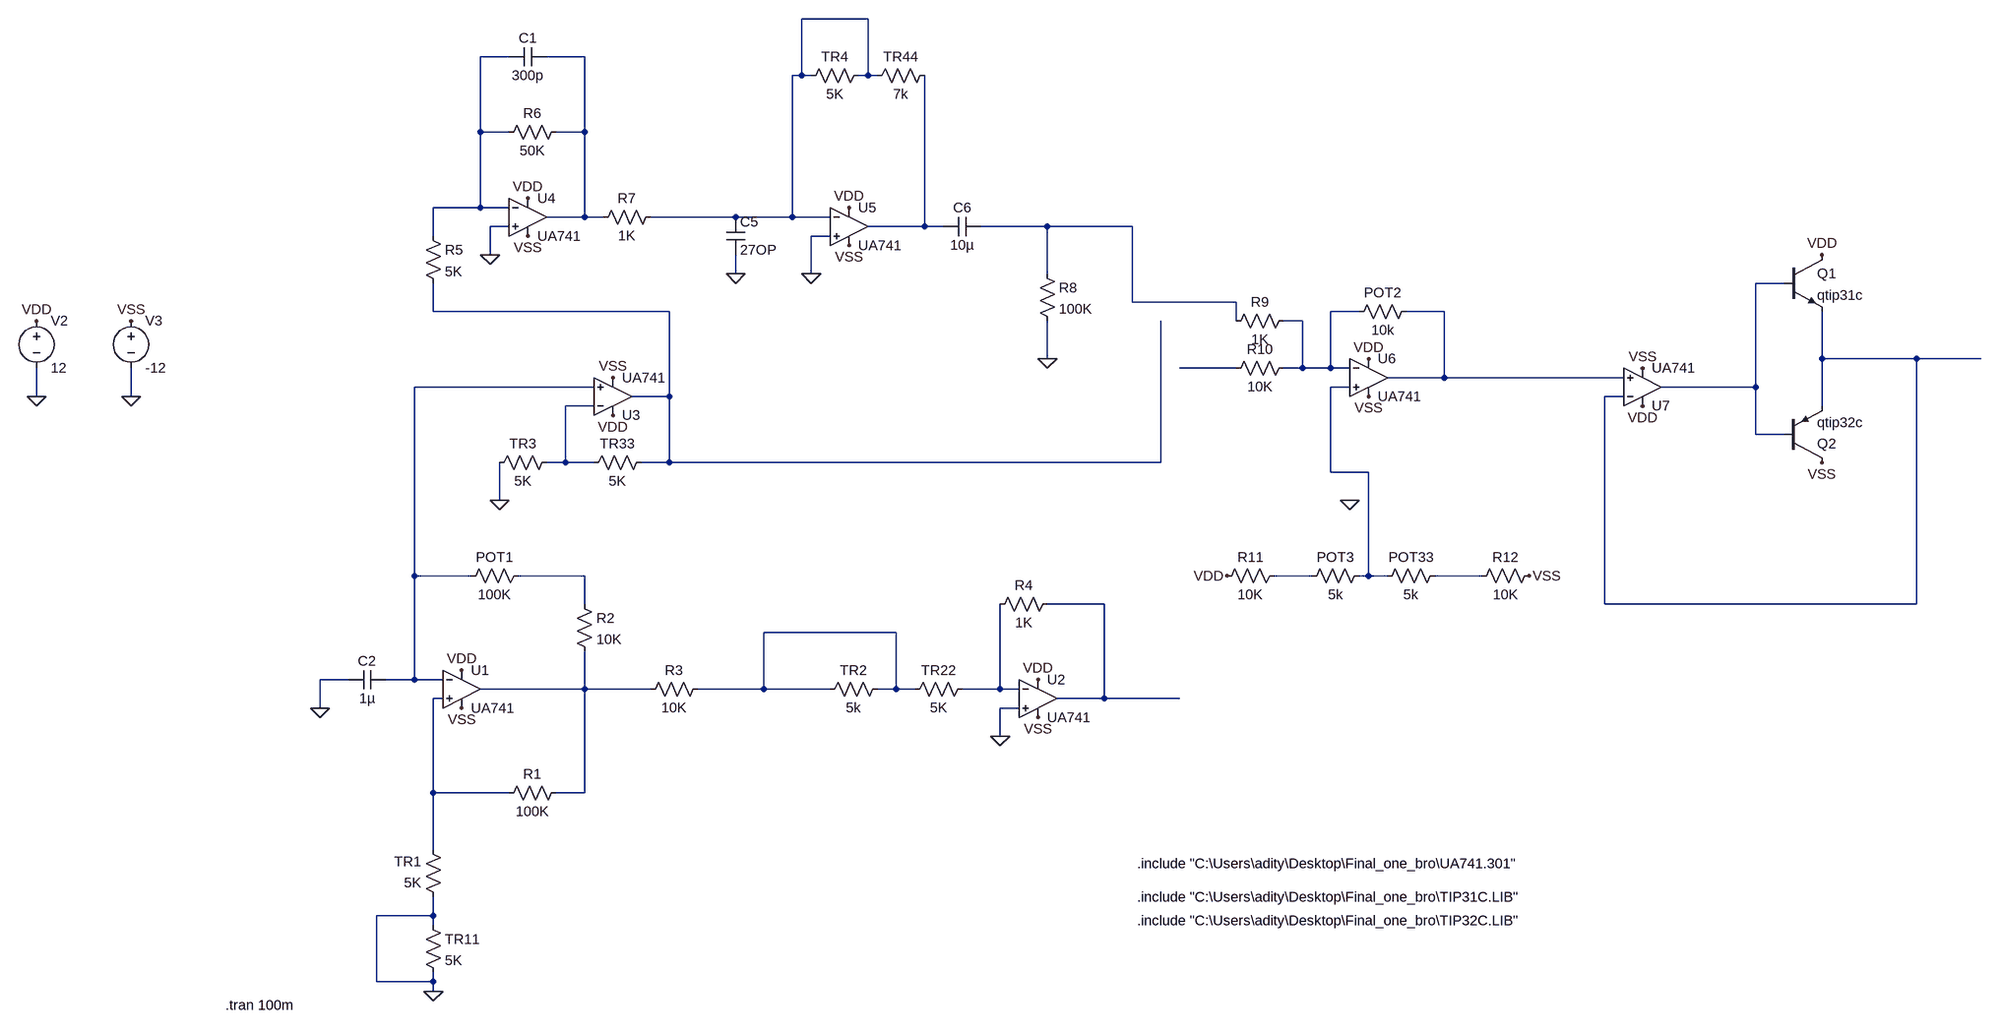
[diagram p0: schematic function_generator_finalllll.asc]
function_generator_finalllll.asc, the LTspice schematic file:
Version 4
SHEET 1 2436 792
WIRE 528 -896 416 -896
WIRE -80 -832 -128 -832
WIRE 48 -832 -16 -832
WIRE 416 -800 416 -896
WIRE 416 -800 400 -800
WIRE 432 -800 416 -800
WIRE 528 -800 528 -896
WIRE 528 -800 512 -800
WIRE 544 -800 528 -800
WIRE -128 -704 -128 -832
WIRE -80 -704 -128 -704
WIRE 48 -704 48 -832
WIRE 48 -704 0 -704
WIRE -128 -576 -128 -704
WIRE -128 -576 -208 -576
WIRE -80 -576 -128 -576
WIRE 48 -560 48 -704
WIRE 48 -560 -16 -560
WIRE 80 -560 48 -560
WIRE 304 -560 160 -560
WIRE 400 -560 400 -800
WIRE 400 -560 304 -560
WIRE 464 -560 400 -560
WIRE -80 -544 -112 -544
WIRE 624 -544 624 -800
WIRE 624 -544 528 -544
WIRE 656 -544 624 -544
WIRE 832 -544 720 -544
WIRE 976 -544 832 -544
WIRE -208 -528 -208 -576
WIRE 464 -528 432 -528
WIRE -112 -496 -112 -544
WIRE 304 -464 304 -496
WIRE 432 -464 432 -528
WIRE 832 -464 832 -544
WIRE 2080 -448 2032 -448
WIRE 976 -416 976 -544
WIRE 1152 -416 976 -416
WIRE -208 -400 -208 -448
WIRE 192 -400 -208 -400
WIRE 1360 -400 1312 -400
WIRE 1504 -400 1440 -400
WIRE 1152 -384 1152 -416
WIRE 1264 -384 1232 -384
WIRE 832 -320 832 -384
WIRE 2144 -320 2144 -400
WIRE 2304 -320 2144 -320
WIRE 2432 -320 2304 -320
WIRE 1152 -304 1056 -304
WIRE 1264 -304 1264 -384
WIRE 1264 -304 1232 -304
WIRE 1312 -304 1312 -400
WIRE 1312 -304 1264 -304
WIRE 1344 -304 1312 -304
WIRE 1504 -288 1504 -400
WIRE 1504 -288 1408 -288
WIRE 1808 -288 1504 -288
WIRE 64 -272 -240 -272
WIRE 1344 -272 1312 -272
WIRE 2032 -272 2032 -448
WIRE 2032 -272 1872 -272
WIRE -960 -256 -960 -304
WIRE -800 -256 -800 -304
WIRE 192 -256 192 -400
WIRE 192 -256 128 -256
WIRE 1808 -256 1776 -256
WIRE 64 -240 16 -240
WIRE 2144 -240 2144 -320
WIRE 2032 -192 2032 -272
WIRE 2080 -192 2032 -192
WIRE 16 -144 16 -240
WIRE 16 -144 -16 -144
WIRE 64 -144 16 -144
WIRE 192 -144 192 -256
WIRE 192 -144 144 -144
WIRE 1024 -144 1024 -384
WIRE 1024 -144 192 -144
WIRE 1312 -128 1312 -272
WIRE 1376 -128 1312 -128
WIRE -96 -80 -96 -144
WIRE -240 48 -240 -272
WIRE -144 48 -240 48
WIRE 48 48 -64 48
WIRE 1280 48 1216 48
WIRE 1376 48 1376 -128
WIRE 1376 48 1360 48
WIRE 1408 48 1376 48
WIRE 1568 48 1488 48
WIRE 48 96 48 48
WIRE 928 96 832 96
WIRE 1776 96 1776 -256
WIRE 2304 96 2304 -320
WIRE 2304 96 1776 96
WIRE 576 144 352 144
WIRE -352 224 -400 224
WIRE -240 224 -240 48
WIRE -240 224 -288 224
WIRE -192 224 -240 224
WIRE 48 240 48 176
WIRE 48 240 -128 240
WIRE 160 240 48 240
WIRE 352 240 352 144
WIRE 352 240 240 240
WIRE 464 240 352 240
WIRE 576 240 576 144
WIRE 576 240 544 240
WIRE 608 240 576 240
WIRE 752 240 752 96
WIRE 752 240 688 240
WIRE 784 240 752 240
WIRE -192 256 -208 256
WIRE 928 256 928 96
WIRE 928 256 848 256
WIRE 1056 256 928 256
WIRE -400 272 -400 224
WIRE 784 272 752 272
WIRE 752 320 752 272
WIRE -208 416 -208 256
WIRE -80 416 -208 416
WIRE 48 416 48 240
WIRE 48 416 0 416
WIRE -208 512 -208 416
WIRE -208 624 -208 592
WIRE -208 624 -304 624
WIRE -208 640 -208 624
WIRE -304 736 -304 624
WIRE -208 736 -208 720
WIRE -208 736 -304 736
WIRE -208 752 -208 736
FLAG -400 272 0
FLAG 752 320 0
FLAG -208 752 0
FLAG -96 -80 0
FLAG -112 -496 0
FLAG 304 -464 0
FLAG 432 -464 0
FLAG 832 -320 0
FLAG -960 -256 0
FLAG -800 -256 0
FLAG -960 -384 VDD
FLAG -48 -592 VDD
FLAG 496 -576 VDD
FLAG -160 208 VDD
FLAG 816 224 VDD
FLAG -800 -384 VSS
FLAG -160 272 VSS
FLAG 816 288 VSS
FLAG -48 -528 VSS
FLAG 496 -512 VSS
FLAG 96 -224 VDD
FLAG 96 -288 VSS
FLAG 2144 -496 VDD
FLAG 2144 -144 VSS
FLAG 1376 -320 VDD
FLAG 1840 -240 VDD
FLAG 1376 -256 VSS
FLAG 1840 -304 VSS
FLAG 1136 48 VDD
FLAG 1648 48 VSS
FLAG 1344 -80 0
SYMBOL OpAmps\\opamp2 -160 176 R0
SYMATTR InstName U1
SYMATTR Value UA741
SYMBOL OpAmps\\opamp2 816 192 R0
SYMATTR InstName U2
SYMATTR Value UA741
SYMBOL res 32 80 R0
SYMATTR InstName R2
SYMATTR Value 10K
SYMBOL res 256 224 R90
WINDOW 0 0 56 VBottom 2
WINDOW 3 32 56 VTop 2
SYMATTR InstName R3
SYMATTR Value 10K
SYMBOL res 704 224 R90
WINDOW 0 0 56 VBottom 2
WINDOW 3 32 56 VTop 2
SYMATTR InstName TR22
SYMATTR Value 5K
SYMBOL res -192 608 R180
WINDOW 0 36 76 Left 2
WINDOW 3 36 40 Left 2
SYMATTR InstName TR1
SYMATTR Value 5K
SYMBOL res 848 80 R90
WINDOW 0 0 56 VBottom 2
WINDOW 3 32 56 VTop 2
SYMATTR InstName R4
SYMATTR Value 1K
SYMBOL res 16 400 R90
WINDOW 0 0 56 VBottom 2
WINDOW 3 32 56 VTop 2
SYMATTR InstName R1
SYMATTR Value 100K
SYMBOL res -48 32 R90
WINDOW 0 0 56 VBottom 2
WINDOW 3 32 56 VTop 2
SYMATTR InstName POT1
SYMATTR Value 100K
SYMBOL res -224 624 R0
SYMATTR InstName TR11
SYMATTR Value 5K
SYMBOL OpAmps\\opamp2 96 -192 M180
SYMATTR InstName U3
SYMATTR Value UA741
SYMBOL res 160 -160 R90
WINDOW 0 0 56 VBottom 2
WINDOW 3 32 56 VTop 2
SYMATTR InstName TR33
SYMATTR Value 5K
SYMBOL res 0 -160 R90
WINDOW 0 0 56 VBottom 2
WINDOW 3 32 56 VTop 2
SYMATTR InstName TR3
SYMATTR Value 5K
SYMBOL res 560 224 R90
WINDOW 0 0 56 VBottom 2
WINDOW 3 32 56 VTop 2
SYMATTR InstName TR2
SYMATTR Value 5k
SYMBOL OpAmps\\opamp2 -48 -624 R0
SYMATTR InstName U4
SYMATTR Value UA741
SYMBOL OpAmps\\opamp2 496 -608 R0
SYMATTR InstName U5
SYMATTR Value UA741
SYMBOL res -224 -544 R0
SYMATTR InstName R5
SYMATTR Value 5K
SYMBOL res 16 -720 R90
WINDOW 0 0 56 VBottom 2
WINDOW 3 32 56 VTop 2
SYMATTR InstName R6
SYMATTR Value 50K
SYMBOL res 176 -576 R90
WINDOW 0 0 56 VBottom 2
WINDOW 3 32 56 VTop 2
SYMATTR InstName R7
SYMATTR Value 1K
SYMBOL cap 288 -560 R0
SYMATTR InstName C5
SYMATTR Value 27OP
SYMBOL cap 720 -560 R90
WINDOW 0 0 32 VBottom 2
WINDOW 3 32 32 VTop 2
SYMATTR InstName C6
SYMATTR Value 10µ
SYMBOL res 528 -816 R90
WINDOW 0 0 56 VBottom 2
WINDOW 3 32 56 VTop 2
SYMATTR InstName TR4
SYMATTR Value 5K
SYMBOL res 640 -816 R90
WINDOW 0 0 56 VBottom 2
WINDOW 3 32 56 VTop 2
SYMATTR InstName TR44
SYMATTR Value 7k
SYMBOL res 816 -480 R0
SYMATTR InstName R8
SYMATTR Value 100K
SYMBOL cap -16 -848 R90
WINDOW 0 0 32 VBottom 2
WINDOW 3 32 32 VTop 2
SYMATTR InstName C1
SYMATTR Value 300p
SYMBOL cap -288 208 R90
WINDOW 0 0 32 VBottom 2
WINDOW 3 32 32 VTop 2
SYMATTR InstName C2
SYMATTR Value 1µ
SYMBOL voltage -960 -400 R0
WINDOW 123 0 0 Left 0
WINDOW 39 0 0 Left 0
SYMATTR InstName V2
SYMATTR Value 12
SYMBOL voltage -800 -400 R0
WINDOW 123 0 0 Left 0
WINDOW 39 0 0 Left 0
SYMATTR InstName V3
SYMATTR Value -12
SYMBOL OpAmps\\opamp2 1376 -352 R0
SYMATTR InstName U6
SYMATTR Value UA741
SYMBOL OpAmps\\opamp2 1840 -208 M180
SYMATTR InstName U7
SYMATTR Value UA741
SYMBOL res 1248 -400 R90
WINDOW 0 0 56 VBottom 2
WINDOW 3 32 56 VTop 2
SYMATTR InstName R9
SYMATTR Value 1K
SYMBOL res 1248 -320 R90
WINDOW 0 0 56 VBottom 2
WINDOW 3 32 56 VTop 2
SYMATTR InstName R10
SYMATTR Value 10K
SYMBOL res 1456 -416 R90
WINDOW 0 0 56 VBottom 2
WINDOW 3 32 56 VTop 2
SYMATTR InstName POT2
SYMATTR Value 10k
SYMBOL npn 2080 -496 R0
SYMATTR InstName Q1
SYMATTR Value qtip31c
SYMBOL pnp 2080 -144 M180
SYMATTR InstName Q2
SYMATTR Value qtip32c
SYMBOL res 1232 32 R90
WINDOW 0 0 56 VBottom 2
WINDOW 3 32 56 VTop 2
SYMATTR InstName R11
SYMATTR Value 10K
SYMBOL res 1664 32 R90
WINDOW 0 0 56 VBottom 2
WINDOW 3 32 56 VTop 2
SYMATTR InstName R12
SYMATTR Value 10K
SYMBOL res 1376 32 R90
WINDOW 0 0 56 VBottom 2
WINDOW 3 32 56 VTop 2
SYMATTR InstName POT3
SYMATTR Value 5k
SYMBOL res 1504 32 R90
WINDOW 0 0 56 VBottom 2
WINDOW 3 32 56 VTop 2
SYMATTR InstName POT33
SYMATTR Value 5k
TEXT 984 536 Left 2 !.include "C:\\Users\\adity\\Desktop\\Final_one_bro\\UA741.301"
TEXT -560 776 Left 2 !.tran 100m
TEXT 984 592 Left 2 !.include "C:\\Users\\adity\\Desktop\\Final_one_bro\\TIP31C.LIB"
TEXT 984 632 Left 2 !.include "C:\\Users\\adity\\Desktop\\Final_one_bro\\TIP32C.LIB"

The netlist it stands for:
* function_generator_finalllll.asc
XU1 N022 N012 VDD VSS N020 UA741  ; pins In+ In- V+ V- OUT
XU2 0 N021 VDD VSS N018 UA741  ; pins In+ In- V+ V- OUT
R2 N015 N020 10K
R3 N019 N020 10K
R§TR22 N021 N019 5K
R§TR1 0 N022 5K
R4 N018 N021 1K
R1 N020 N022 100K
R§POT1 N015 N012 100K
R§TR11 0 0 5K
XU3 N012 N014 VDD VSS N007 UA741  ; pins In+ In- V+ V- OUT
R§TR33 N007 N014 5K
R§TR3 N014 0 5K
R§TR2 N019 N019 5k
XU4 0 N002 VDD VSS N003 UA741  ; pins In+ In- V+ V- OUT
XU5 0 N001 VDD VSS N004 UA741  ; pins In+ In- V+ V- OUT
R5 N002 N007 5K
R6 N003 N002 50K
R7 N001 N003 1K
C5 N001 0 27OP
C6 N005 N004 10µ
R§TR4 N001 N001 5K
R§TR44 N004 N001 7k
R8 N005 0 100K
C1 N003 N002 300p
C2 N012 0 1µ
V2 VDD 0 12
V3 VSS 0 -12
XU6 N013 N008 VDD VSS N009 UA741  ; pins In+ In- V+ V- OUT
XU7 N009 N010 VDD VSS N006 UA741  ; pins In+ In- V+ V- OUT
R9 N008 N005 1K
R10 N008 N011 10K
R§POT2 N009 N008 10k
Q1 VDD N006 N010 0 qtip31c
Q2 VSS N006 N010 0 qtip32c
R11 N016 VDD 10K
R12 VSS N017 10K
R§POT3 N013 N016 5k
R§POT33 N017 N013 5k
.model NPN NPN
.model PNP PNP
.lib standard.bjt
.include "C:\Users\adity\Desktop\Final_one_bro\UA741.301"
.tran 100m
.include "C:\Users\adity\Desktop\Final_one_bro\TIP31C.LIB"
.include "C:\Users\adity\Desktop\Final_one_bro\TIP32C.LIB"
.backanno
.end